# EAGLE board electrosteel2020 (EAGLE 9.2.2), part 1 of 2
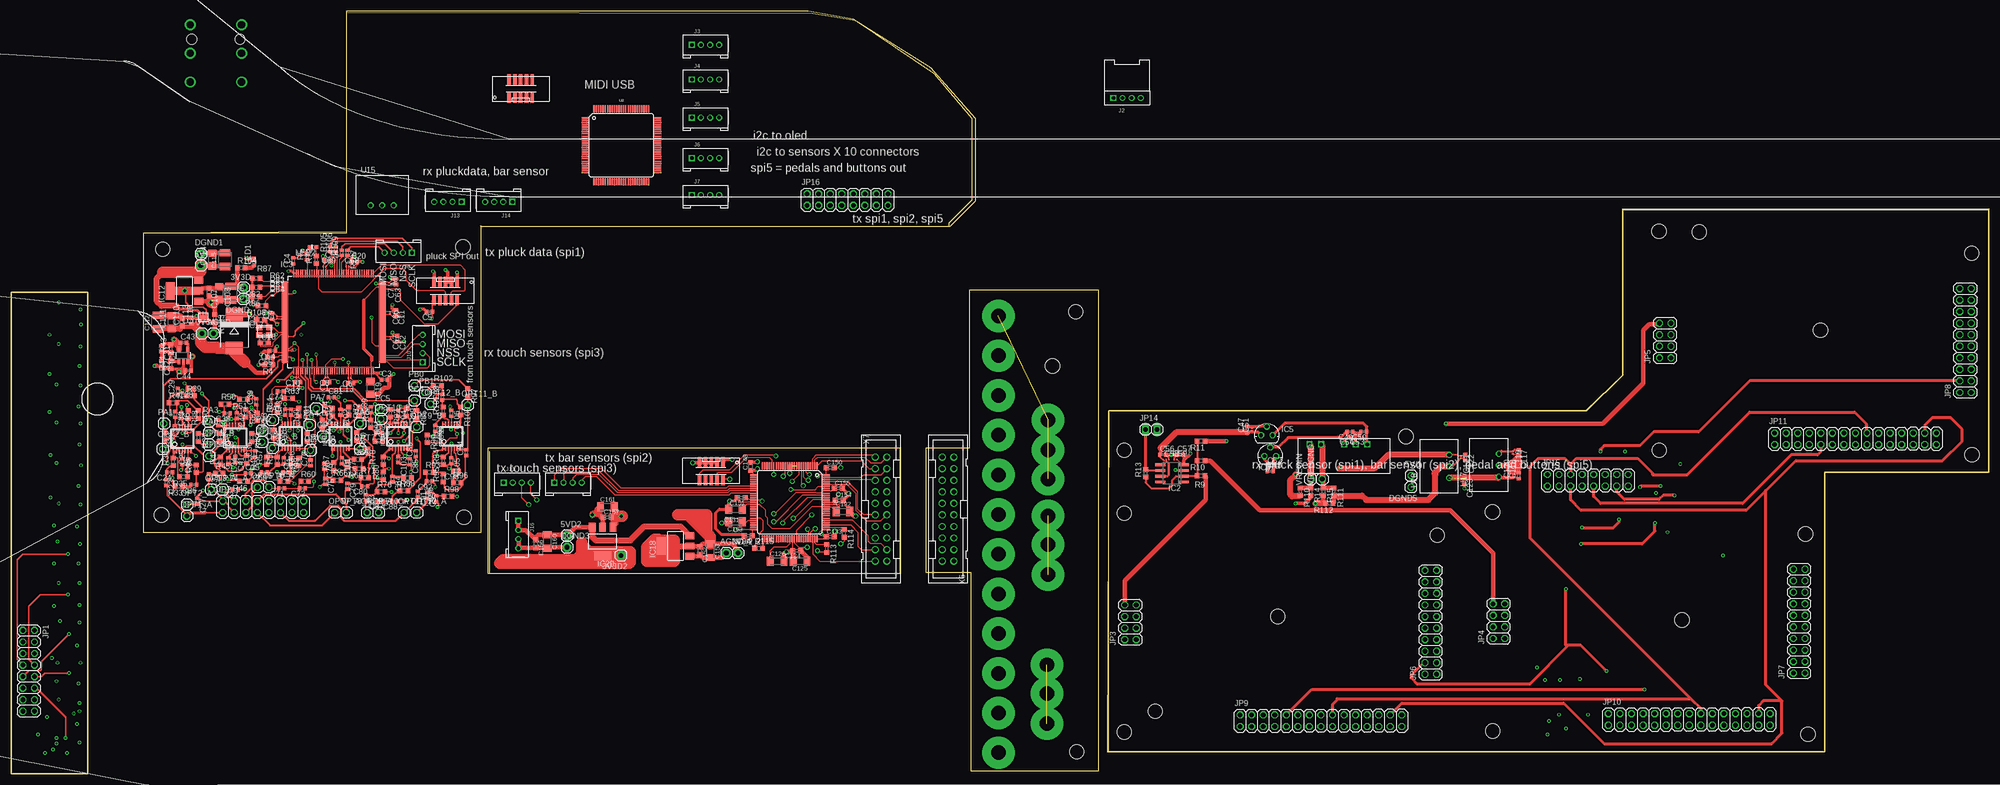
[diagram p5: board, top side]
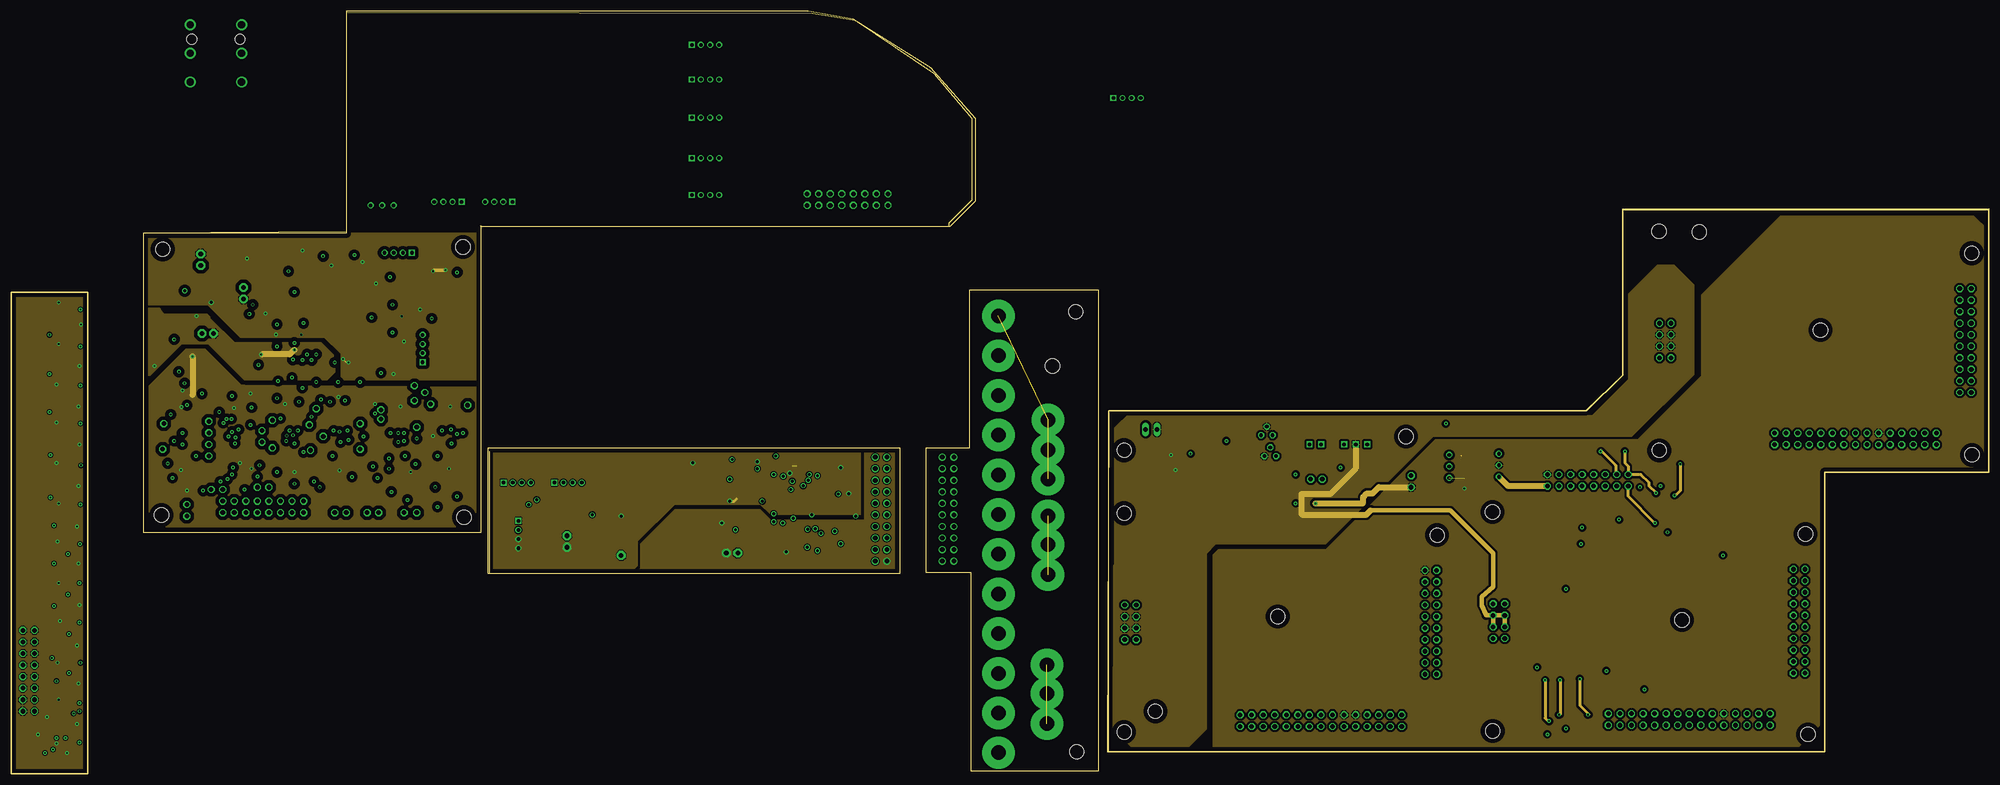
[diagram p6: board, inner layer Route2]
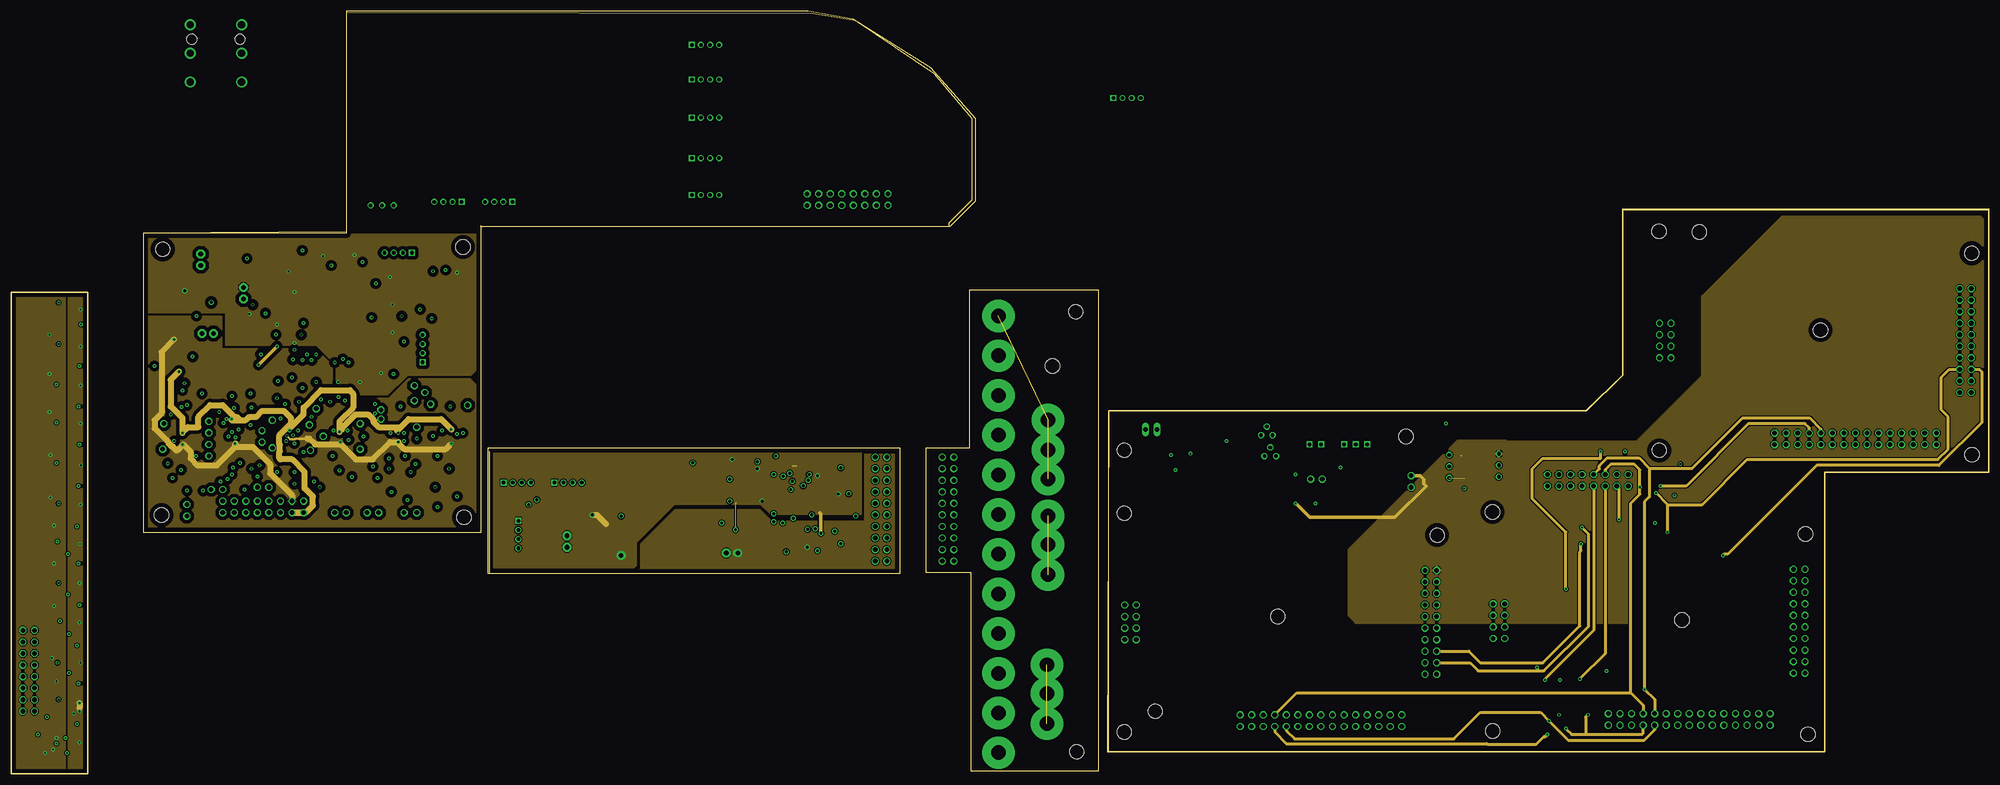
[diagram p7: board, inner layer Route15]
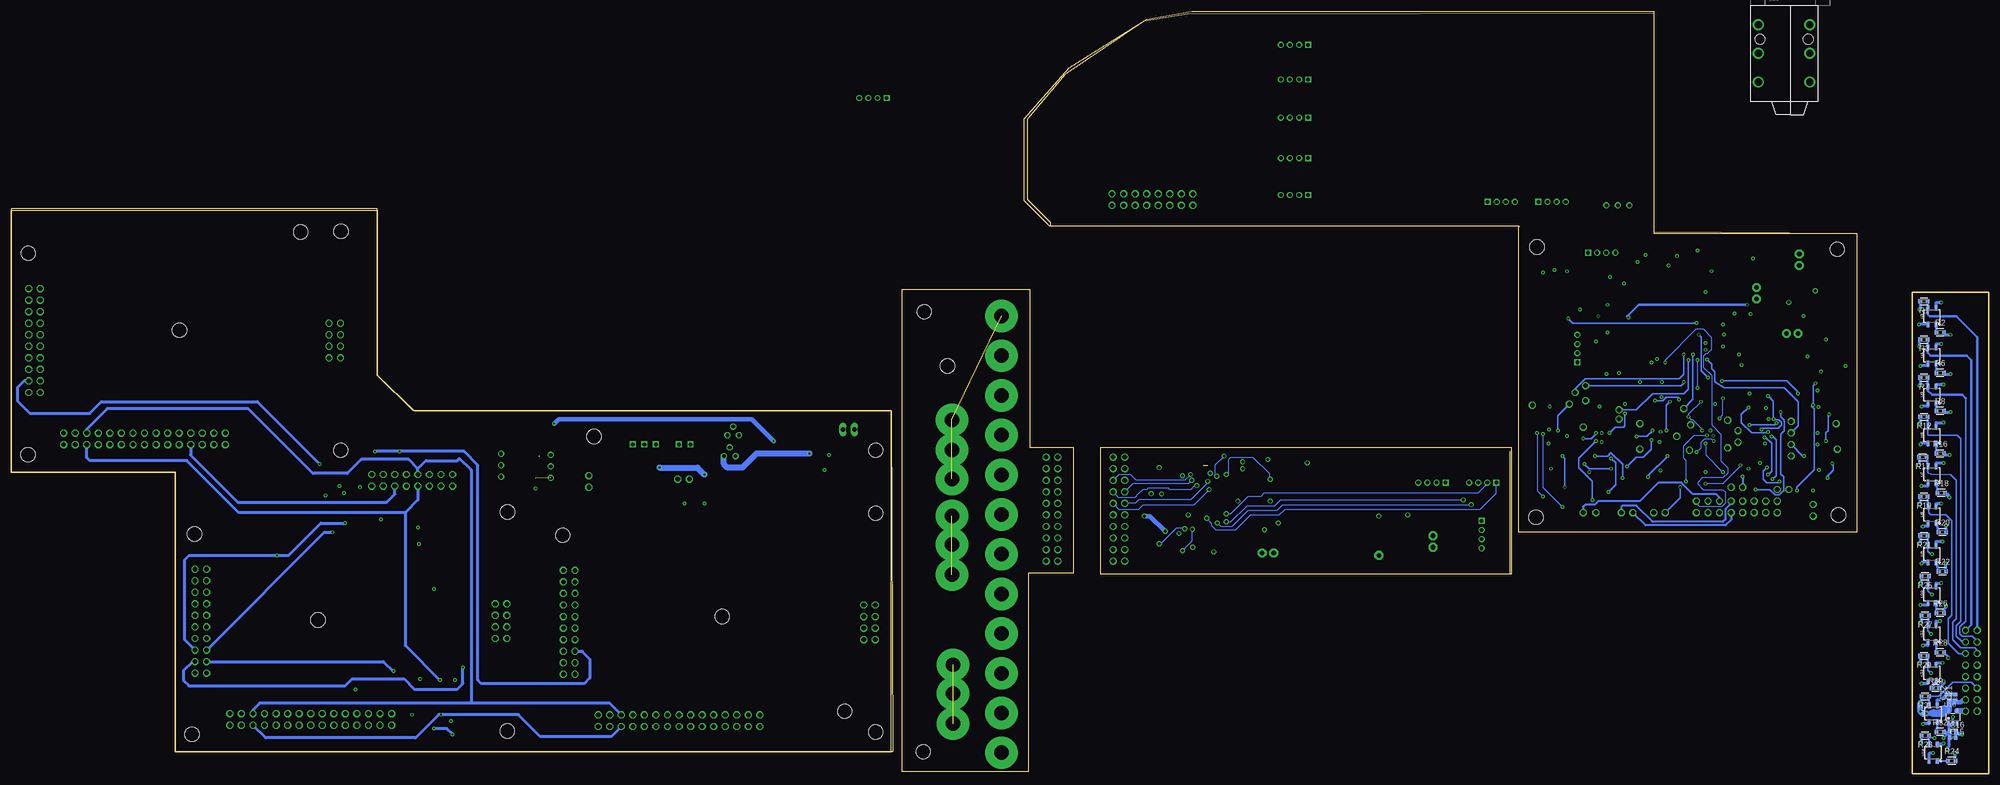
[diagram p8: board, bottom side, seen from below]

Size 434.85 x 167.64 mm. Coordinates in mm from the lower left corner, seen from the top.
Outline: 103.38,120.4 103.38,53.09 28.96,53.09 28.96,118.87 73.66,118.87 73.66,167.64 175.26,167.64 185.17,165.86 202.18,155.19 212.09,144.02 212.09,125.98 206.5,120.4 103.38,120.4
Outline: 103.38,120.4 103.12,120.4
Outline: 241.3,79.76 241.05,4.83 398.78,4.83 398.78,66.29 434.85,66.29 434.85,123.95 354.33,123.95 354.33,87.63 346.2,79.76 241.3,79.76
Outline: 0,105.92 16.76,105.92 16.76,0 0,0 0,105.92
Outline: 210.82,106.43 239.01,106.43 239.01,0.51 211.07,0.51 211.07,44.2 201.17,44.2 201.17,71.63 210.82,71.63 210.82,106.43
Outline: 195.33,71.63 195.33,43.94 104.9,43.94 104.9,71.63 195.33,71.63
Copper layers (1+2*15+16): Top 0.035mm / dielectric 0.5mm / Route2 0.035mm / dielectric 0.5mm / Route15 0.035mm / dielectric 0.5mm / Bottom 0.035mm
Design rules "default *": minimum track width 6mil, minimum drill 0.35mm, track to track 9mil, track to pad 9mil, pad to pad 9mil, via to via 9mil, smd to smd 9mil, copper to edge 40mil, drill to drill 6mil, minimum pad ring 10mil, minimum via ring 8mil, stop-mask expansion 4mil, vias tented up to drill 0mil, thermal gap 10mil
Holes 3.17 mm at 244.73,57.28 313.56,52.45 244.73,9.14 325.75,57.53 394.59,52.7 325.81,9.37 362.33,119.28 431.14,114.45 362.41,71.09 234.31,4.83 234.06,101.6 228.98,89.66 33.02,56.9 33.27,115.32 99.31,115.82 99.57,56.39 278.51,34.54 367.41,33.78 397.89,97.54 306.7,74.17 244.73,71.12 431.17,70.1 371.22,119.13 251.59,13.72 395.1,8.64
Milling: 38 lines

## Footprints (pad centres in the part's own frame; a part is rotated, then mirrored left to right if it is on the bottom)
1X01 = drill 1.016 pad 1.93 octagon: 1 0,0
1X01' = drill 1.016 octagon: 1 0,0
C0402 = smd 0.7 x 0.9: 1 -0.65,0; 2 0.65,0
C0201 = smd 0.25 x 0.35: 1 -0.25,0; 2 0.25,0
C0603 = smd 1.1 x 1: 1 -0.85,0; 2 0.85,0
C1206 = smd 1.6 x 1.8: 1 -1.4,0; 2 1.4,0
SMC_B = smd 1.6 x 2.4: + -1.5,0; - 1.5,0
C0603K = smd 1.05 x 1.08: 1 -0.875,0; 2 0.875,0
C1206K = smd 1.5 x 2: 1 -1.5,0; 2 1.5,0
SMC = smd 2.8 x 3.8: A 3.7,0; C -3.7,0
TSSOP14 = smd 0.305 x 0.991: 1 -1.905,-2.718; 2 -1.27,-2.718; 3 -0.635,-2.718; 4 0,-2.718; 5 0.635,-2.718; 6 1.27,-2.718; 7 1.905,-2.718; 8 1.905,2.718; 9 1.27,2.718; 10 0.635,2.718; 11 0,2.718; 12 -0.635,2.718; 13 -1.27,2.718; 14 -1.905,2.718
SO08 = smd 0.6 x 2.2: 1 -1.905,-2.6; 2 -0.635,-2.6; 3 0.635,-2.6; 4 1.905,-2.6; 5 1.905,2.6; 6 0.635,2.6; 7 -0.635,2.6; 8 -1.905,2.6
QFP50P2200X2200X160-144N = smd 1.56 x 0.28: 1 -10.68,8.75; 2 -10.68,8.25; 3 -10.68,7.75; 4 -10.68,7.25; 5 -10.68,6.75; 6 -10.68,6.25; 7 -10.68,5.75; 8 -10.68,5.25; 9 -10.68,4.75; 10 -10.68,4.25; 11 -10.68,3.75; 12 -10.68,3.25; 13 -10.68,2.75; 14 -10.68,2.25; 15 -10.68,1.75; 16 -10.68,1.25; 17 -10.68,0.75; 18 -10.68,0.25; 19 -10.68,-0.25; 20 -10.68,-0.75; 21 -10.68,-1.25; 22 -10.68,-1.75; 23 -10.68,-2.25; 24 -10.68,-2.75; 25 -10.68,-3.25; 26 -10.68,-3.75; 27 -10.68,-4.25; 28 -10.68,-4.75; 29 -10.68,-5.25; 30 -10.68,-5.75; 31 -10.68,-6.25; 32 -10.68,-6.75; 33 -10.68,-7.25; 34 -10.68,-7.75; 35 -10.68,-8.25; 36 -10.68,-8.75; 73 10.68,-8.75; 74 10.68,-8.25; 75 10.68,-7.75; 76 10.68,-7.25; 77 10.68,-6.75; 78 10.68,-6.25; 79 10.68,-5.75; 80 10.68,-5.25; 81 10.68,-4.75; 82 10.68,-4.25; 83 10.68,-3.75; 84 10.68,-3.25; 85 10.68,-2.75; 86 10.68,-2.25; 87 10.68,-1.75; 88 10.68,-1.25; 89 10.68,-0.75; 90 10.68,-0.25; 91 10.68,0.25; 92 10.68,0.75; 93 10.68,1.25; 94 10.68,1.75; 95 10.68,2.25; 96 10.68,2.75; 97 10.68,3.25; 98 10.68,3.75; 99 10.68,4.25; 100 10.68,4.75; 101 10.68,5.25; 102 10.68,5.75; 103 10.68,6.25; 104 10.68,6.75; 105 10.68,7.25; 106 10.68,7.75; 107 10.68,8.25; 108 10.68,8.75 | smd 0.28 x 1.56: 37 -8.75,-10.68; 38 -8.25,-10.68; 39 -7.75,-10.68; 40 -7.25,-10.68; 41 -6.75,-10.68; 42 -6.25,-10.68; 43 -5.75,-10.68; 44 -5.25,-10.68; 45 -4.75,-10.68; 46 -4.25,-10.68; 47 -3.75,-10.68; 48 -3.25,-10.68; 49 -2.75,-10.68; 50 -2.25,-10.68; 51 -1.75,-10.68; 52 -1.25,-10.68; 53 -0.75,-10.68; 54 -0.25,-10.68; 55 0.25,-10.68; 56 0.75,-10.68; 57 1.25,-10.68; 58 1.75,-10.68; 59 2.25,-10.68; 60 2.75,-10.68; 61 3.25,-10.68; 62 3.75,-10.68; 63 4.25,-10.68; 64 4.75,-10.68; 65 5.25,-10.68; 66 5.75,-10.68; 67 6.25,-10.68; 68 6.75,-10.68; 69 7.25,-10.68; 70 7.75,-10.68; 71 8.25,-10.68; 72 8.75,-10.68; 109 8.75,10.68; 110 8.25,10.68; 111 7.75,10.68; 112 7.25,10.68; 113 6.75,10.68; 114 6.25,10.68; 115 5.75,10.68; 116 5.25,10.68; 117 4.75,10.68; 118 4.25,10.68; 119 3.75,10.68; 120 3.25,10.68; 121 2.75,10.68; 122 2.25,10.68; 123 1.75,10.68; 124 1.25,10.68; 125 0.75,10.68; 126 0.25,10.68; 127 -0.25,10.68; 128 -0.75,10.68; 129 -1.25,10.68; 130 -1.75,10.68; 131 -2.25,10.68; 132 -2.75,10.68; 133 -3.25,10.68; 134 -3.75,10.68; 135 -4.25,10.68; 136 -4.75,10.68; 137 -5.25,10.68; 138 -5.75,10.68; 139 -6.25,10.68; 140 -6.75,10.68; 141 -7.25,10.68; 142 -7.75,10.68; 143 -8.25,10.68; 144 -8.75,10.68
SOT23-5 = smd 0.6 x 1.2: 1 -0.95,-1.306; 2 0,-1.306; 3 0.95,-1.306; 4 0.95,1.306; 5 -0.95,1.306
78LXX = drill 0.813 octagon: GND 0,1.905; IN 1.27,0; OUT -1.27,0
79LXX = drill 0.813 octagon: GND -1.27,0; IN 0,1.905; OUT 1.27,0
6-WSON = smd 0.45 x 0.3: 1 -0.975,0.65; 2 -0.975,0; 3 -0.975,-0.65; 4 0.975,-0.65; 5 0.975,0; 6 0.975,0.65 | smd 0.9 x 1.6: PAD 0,0
SOT223 = smd 1.499 x 2.007: 1 -2.261,-3.15; 2 0.025,-3.15; 3 2.311,-3.15 | smd 3.81 x 2.007: PAD 0,3.15
AUDIO_JACK_0.25"_TRS_PTH_RA = drill 1.6: RING 10.5,-6.95; RING-NORM 10.5,4.35; SLEEVE 4.2,-6.95; SLEEVE-NORM 4.2,4.35; TIP 16.8,-6.95; TIP-NORM 16.8,4.35 | hole 2.2: 7.4,4; 7.4,-6.6
HW4-2.0-90D = drill 0.8 pad 1.27 square: 1 -3,0 | drill 0.8 pad 1.27: 2 -1,0; 3 1,0; 4 3,0
HW4-2.0 = drill 0.8 pad 1.27 square: 1 -3,0 | drill 0.8 pad 1.27: 2 -1,0; 3 1,0; 4 3,0
RJ45-8 = drill 1 pad 1.88 square: 1 -4.445,6.35 | drill 1 pad 1.88: 2 -3.175,8.89; 3 -1.905,6.35; 4 -0.635,8.89; 5 0.635,6.35; 6 1.905,8.89; 7 3.175,6.35; 8 4.445,8.89 | hole 3.2: -5.715,0; 5.715,0
CUI_UJ31-CH-312-SMT-TR = smd 0.32 x 0.7: A1 0,0; A2 0.5,0; A3 1,0; A4 1.5,0; A5 2,0; A6 2.5,0; A7 3,0; A8 3.5,0; A9 4,0; A10 4.5,0; A11 5,0; A12 5.5,0 | drill 0.4 pad 0.6: B1 5.55,-1.31; B2 5.15,-2.01; B3 4.35,-2.01; B4 3.95,-1.31; B5 3.55,-2.01; B6 3.15,-1.31; B7 2.35,-1.31; B8 1.95,-2.01; B9 1.55,-1.31; B10 1.15,-2.01; B11 0.35,-2.01; B12 -0.05,-1.31 | drill 0.6 pad 0.7 long: SH1 -0.62,0.89; SH2 6.12,0.89 | drill 0.6 pad 0.8 long: SH3 -1.255,-1.66; SH4 6.755,-1.66 | drill 0.6 pad 0.9 long: SH5 -1.58,-2.16; SH6 7.08,-2.16; SH7 -1.58,-7.86; SH8 7.08,-7.86 | hole 0.85: -0.85,-0.66; 6.35,-0.66
2X08 = drill 1.016 octagon: 1 -8.89,-1.27; 2 -8.89,1.27; 3 -6.35,-1.27; 4 -6.35,1.27; 5 -3.81,-1.27; 6 -3.81,1.27; 7 -1.27,-1.27; 8 -1.27,1.27; 9 1.27,-1.27; 10 1.27,1.27; 11 3.81,-1.27; 12 3.81,1.27; 13 6.35,-1.27; 14 6.35,1.27; 15 8.89,-1.27; 16 8.89,1.27
2X04 = drill 1.016 octagon: 1 -3.81,-1.27; 2 -3.81,1.27; 3 -1.27,-1.27; 4 -1.27,1.27; 5 1.27,-1.27; 6 1.27,1.27; 7 3.81,-1.27; 8 3.81,1.27
2X10 = drill 1.016 octagon: 1 -11.43,-1.27; 2 -11.43,1.27; 3 -8.89,-1.27; 4 -8.89,1.27; 5 -6.35,-1.27; 6 -6.35,1.27; 7 -3.81,-1.27; 8 -3.81,1.27; 9 -1.27,-1.27; 10 -1.27,1.27; 11 1.27,-1.27; 12 1.27,1.27; 13 3.81,-1.27; 14 3.81,1.27; 15 6.35,-1.27; 16 6.35,1.27; 17 8.89,-1.27; 18 8.89,1.27; 19 11.43,-1.27; 20 11.43,1.27
2X15 = drill 1.016 octagon: 1 -17.78,-1.27; 2 -17.78,1.27; 3 -15.24,-1.27; 4 -15.24,1.27; 5 -12.7,-1.27; 6 -12.7,1.27; 7 -10.16,-1.27; 8 -10.16,1.27; 9 -7.62,-1.27; 10 -7.62,1.27; 11 -5.08,-1.27; 12 -5.08,1.27; 13 -2.54,-1.27; 14 -2.54,1.27; 15 0,-1.27; 16 0,1.27; 17 2.54,-1.27; 18 2.54,1.27; 19 5.08,-1.27; 20 5.08,1.27; 21 7.62,-1.27; 22 7.62,1.27; 23 10.16,-1.27; 24 10.16,1.27; 25 12.7,-1.27; 26 12.7,1.27; 27 15.24,-1.27; 28 15.24,1.27; 29 17.78,-1.27; 30 17.78,1.27
1X02 = drill 1.016 long: 1 -1.27,0; 2 1.27,0
1X04 = drill 1.016 long: 1 -3.81,0; 2 -1.27,0; 3 1.27,0; 4 3.81,0
CHIP-LED0603 = smd 0.8 x 0.8: A 0,-0.75; C 0,0.75
NX3225 = smd 1.4 x 1.2: 1 -1.1,-0.8; 2 1.1,-0.8; 3 1.1,0.8; 4 -1.1,0.8
RESC1608X60 = smd 0.799 x 0.974: 1 -0.815,0; 2 0.815,0
R0603 = smd 1 x 1.1: 1 -0.85,0; 2 0.85,0
R0402 = smd 0.7 x 0.9: 1 -0.55,0; 2 0.55,0
R0201 = smd 0.28 x 0.43: 1 -0.255,0; 2 0.255,0
TACTILE_SWITCH_PTH_6.0MM = drill 1.016 pad 1.88: 1 -3.251,2.261; 2 3.251,2.261; 3 -3.251,-2.261; 4 3.251,-2.261
TQFP-100-14X14MM = smd 1.5 x 0.27: 1 -8,6; 2 -8,5.5; 3 -8,5; 4 -8,4.5; 5 -8,4; 6 -8,3.5; 7 -8,3; 8 -8,2.5; 9 -8,2; 10 -8,1.5; 11 -8,1; 12 -8,0.5; 13 -8,0; 14 -8,-0.5; 15 -8,-1; 16 -8,-1.5; 17 -8,-2; 18 -8,-2.5; 19 -8,-3; 20 -8,-3.5; 21 -8,-4; 22 -8,-4.5; 23 -8,-5; 24 -8,-5.5; 25 -8,-6; 51 8,-6; 52 8,-5.5; 53 8,-5; 54 8,-4.5; 55 8,-4; 56 8,-3.5; 57 8,-3; 58 8,-2.5; 59 8,-2; 60 8,-1.5; 61 8,-1; 62 8,-0.5; 63 8,0; 64 8,0.5; 65 8,1; 66 8,1.5; 67 8,2; 68 8,2.5; 69 8,3; 70 8,3.5; 71 8,4; 72 8,4.5; 73 8,5; 74 8,5.5; 75 8,6 | smd 0.27 x 1.5: 26 -6,-8; 27 -5.5,-8; 28 -5,-8; 29 -4.5,-8; 30 -4,-8; 31 -3.5,-8; 32 -3,-8; 33 -2.5,-8; 34 -2,-8; 35 -1.5,-8; 36 -1,-8; 37 -0.5,-8; 38 0,-8; 39 0.5,-8; 40 1,-8; 41 1.5,-8; 42 2,-8; 43 2.5,-8; 44 3,-8; 45 3.5,-8; 46 4,-8; 47 4.5,-8; 48 5,-8; 49 5.5,-8; 50 6,-8; 76 6,8; 77 5.5,8; 78 5,8; 79 4.5,8; 80 4,8; 81 3.5,8; 82 3,8; 83 2.5,8; 84 2,8; 85 1.5,8; 86 1,8; 87 0.5,8; 88 0,8; 89 -0.5,8; 90 -1,8; 91 -1.5,8; 92 -2,8; 93 -2.5,8; 94 -3,8; 95 -3.5,8; 96 -4,8; 97 -4.5,8; 98 -5,8; 99 -5.5,8; 100 -6,8
QRE1113 = smd 1.2 x 0.6: 1 -1.8,-0.9; 2 1.8,-0.9; 3 1.8,0.9; 4 -1.8,0.9
DC-DC_CONVERTER_78XX = drill 0.8: GND 0,0; VIN -2.54,0; VOUT 2.54,0
TEXAS_SOT23-5 = smd 0.55 x 1.2: 1 -0.95,-1.3; 2 0,-1.3; 3 0.95,-1.3; 4 0.95,1.3; 5 -0.95,1.3
RK09 = drill 1.2 square: 1-09 -2.5,-7.5; 2-09 0,-7.5; 3-09 2.5,-7.5 | drill 1.854 square: MOUNT1 -4.683,0; MOUNT2 4.683,0
CMR0512S3C = drill 0.8 square: P$1 -7.62,0; P$2 -5.08,0; P$3 0,0; P$4 2.54,0; P$5 5.08,0
SS-7188VS-A-FLS_RJ45 = drill 0.889 square: P$1 -4.445,4.445; P$2 -3.175,6.985; P$3 -1.905,4.445; P$4 -0.635,6.985; P$5 0.635,4.445; P$6 1.905,6.985; P$7 3.175,4.445; P$8 4.445,6.985 | drill 1.651 square: P$9 -7.874,1.981; P$10 7.874,1.981 | hole 3.277: -5.715,-1.905; 5.715,-1.905
3221-10-0300-00 = smd 0.76 x 2.4: 1 -2.54,-1.87; 2 -2.54,1.97; 3 -1.27,-1.87; 4 -1.27,1.97; 5 0,-1.87; 6 0,1.97; 7 1.27,-1.87; 8 1.27,1.97; 9 2.54,-1.87; 10 2.54,1.97
PAK100/2500-20 = drill 1 pad 1.422: 1 -11.43,-1.27; 2 -11.43,1.27; 3 -8.89,-1.27; 4 -8.89,1.27; 5 -6.35,-1.27; 6 -6.35,1.27; 7 -3.81,-1.27; 8 -3.81,1.27; 9 -1.27,-1.27; 10 -1.27,1.27; 11 1.27,-1.27; 12 1.27,1.27; 13 3.81,-1.27; 14 3.81,1.27; 15 6.35,-1.27; 16 6.35,1.27; 17 8.89,-1.27; 18 8.89,1.27; 19 11.43,-1.27; 20 11.43,1.27

## Placement (x,y rotation side)
3V3A  [1X01]  41.91,96.77 0 top
3V3A_2  [1X01]  159.77,48.51 0 top
3V3D  [1X01]  51.05,106.93 0 top
3V3D2  [1X01]  134.11,48.01 180 top
5V  [1X01]  41.66,111.76 0 top
5V/1  PINHD-1X1  [1X01']  307.85,65.53 0 top
5VD2  [1X01]  122.17,52.32 0 top
AGND  [1X01]  44.45,96.77 0 top
AGND_2  [1X01]  157.23,48.51 0 top
C1  .1uf  [C0402]  69.34,86.11 180 top
C2  .1uf  [C0402]  57.4,100.58 90 top
C3  .1uf  [C0402]  82.04,86.61 0 top
C4  .1uf  [C0402]  61.98,112.78 90 top
C5  .1uf  [C0402]  91.95,101.6 180 top
C6  .01uf  [C0201]  74.37,87 180 top
C7  .01uf  [C0201]  83.06,107.7 270 top
C8  .01uf  [C0201]  69.34,87.12 180 top
C9  .01uf  [C0201]  58.42,100.33 90 top
C10  .01uf  [C0201]  62.86,87.15 180 top
C11  .1uf  [C0402]  84.58,101.35 270 top
C12  .1uf  [C0402]  84.84,95.76 270 top
C13  .1uf  [C0402]  74.68,85.85 180 top
C14  .1uf  [C0402]  62.99,86.11 180 top
C15  .1uf  [C0402]  7.87,7.87 0 bottom
C16  .01uf  [C0402]  7.87,9.4 0 bottom
C17  18pf  [C0603]  54.86,99.82 180 top
C18  18pf  [C0603]  55.63,94.74 0 top
C19  2.2uf  [C1206]  78.99,84.84 270 top
C20  .1uf  [C0402]  75.44,112.52 0 top
C21  .01uf  [C0402]  7.37,16.76 90 bottom
C22  .1uf  [C0402]  8.64,16.76 90 bottom
C23  .1uf  [C0402]  34.04,64.01 270 top
C24  .1uf  [C0402]  34.8,66.29 180 top
C25  .1uf  [C0402]  38.86,68.58 90 top
C26  .1uf  [C0402]  40.13,63.5 180 top
C27  .1uf  [C0402]  40.89,59.94 270 top
C28  .1uf  [C0402]  39.37,84.58 180 top
C29  .1uf  [C0402]  36.58,84.07 90 top
C30  .1uf  [C0402]  36.07,78.99 270 top
C31  .1uf  [C0402]  33.02,93.47 270 top
C32  .1uf  [C0402]  33.02,90.17 270 top
C33  .1uf  [C0402]  43.43,65.28 270 top
C34  .1uf  [C0402]  47.75,68.83 270 top
C35  .1uf  [C0402]  52.07,66.04 0 top
C36  .1uf  [C0402]  53.59,70.36 90 top
C37  .1uf  [C0402]  49.28,62.48 180 top
C38  .1uf  [C0402]  47.5,79.25 180 top
C39  .1uf  [C0402]  53.85,81.79 90 top
C40  .1uf  [C0402]  45.47,77.22 270 top
C41  .1uf  [C0402]  49.28,69.09 270 top
C42  .1uf  [C0402]  49.53,78.74 270 top
C43  .1uf  [C0402]  37.85,94.74 0 top
C44  .1uf  [C0402]  38.86,88.65 180 top
C45  .1uf  [C0402]  37.59,68.58 270 top
C46  .1uf  [C0402]  37.34,78.74 270 top
C47  .1uf  [C0402]  271.78,75.69 90 top
C48  .1uf  [C0402]  276.86,66.55 0 top
C49  .1uf  [C0402]  294.39,75.18 180 top
C50  .1uf  [C0402]  297.43,75.18 180 top
C51  .01uf  [C0201]  272.8,75.69 90 top
C52  .01uf  [C0201]  276.86,67.56 0 top
C53  .01uf  [C0201]  296.93,74.17 180 top
C54  .01uf  [C0201]  294.64,74.17 180 top
C55  .1uf  [C0402]  69.6,112.78 0 top
C56  .1uf  [C0402]  253.24,70.1 0 top
C57  .1uf  [C0402]  257.05,70.1 0 top
C58  .01uf  [C0201]  254.25,69.09 0 top
C59  .01uf  [C0201]  256.03,69.09 0 top
C60  .1uf  [C0402]  55.63,66.29 180 top
C61  .1uf  [C0402]  59.94,68.83 270 top
C62  .1uf  [C0402]  60.45,66.29 0 top
C63  .1uf  [C0402]  84.58,108.2 270 top
C64  .01uf  [C0402]  57.4,92.96 180 top
C65  .01uf  [C0402]  56.87,91.69 180 top
C66  .01uf  [C0201]  83.31,101.35 270 top
C67  .01uf  [C0201]  83.34,95.83 270 top
C68  .01uf  [C0201]  73.91,111.51 0 top
C69  .01uf  [C0201]  68.86,111.51 0 top
C70  .1uf  [C0402]  65.79,68.33 90 top
C71  .1uf  [C0402]  59.44,62.74 180 top
C72  .1uf  [C0402]  64.01,62.74 180 top
C73  .1uf  [C0402]  60.2,79.5 90 top
C74  .1uf  [C0402]  59.18,84.07 180 top
C75  .1uf  [C0402]  69.09,64.26 270 top
C76  .1uf  [C0402]  68.83,67.56 270 top
C77  .1uf  [C0402]  73.91,68.07 270 top
C78  .1uf  [C0402]  78.49,70.87 90 top
C79  .1uf  [C0402]  73.91,63.25 270 top
C80  .1uf  [C0402]  77.72,63.25 180 top
C81  .1uf  [C0402]  70.36,82.8 0 top
C82  .1uf  [C0402]  68.83,80.26 270 top
C83  .1uf  [C0402]  77.98,60.71 270 top
C84  .1uf  [C0402]  83.82,64.77 270 top
C85  .1uf  [C0402]  87.63,68.58 270 top
C86  .1uf  [C0402]  88.9,70.36 90 top
C87  .1uf  [C0402]  81.28,59.94 180 top
C88  .1uf  [C0402]  84.33,59.94 180 top
C89  .1uf  [C0402]  78.99,80.01 90 top
C90  .1uf  [C0402]  80.77,74.93 0 top
C91  .1uf  [C0402]  89.41,61.47 270 top
C92  .1uf  [C0402]  91.95,64.26 180 top
C93  .1uf  [C0402]  97.79,66.55 180 top
C94  .1uf  [C0402]  100.08,70.61 90 top
C95  .1uf  [C0402]  91.44,61.21 270 top
C96  .1uf  [C0402]  93.47,60.45 90 top
C97  .1uf  [C0402]  93.22,75.95 270 top
C98  .1uf  [C0402]  94.74,82.8 90 top
C99  .1uf  [C0402]  61.47,68.83 270 top
C100  .1uf  [C0402]  61.47,79.5 270 top
C101  .1uf  [C0402]  72.64,68.83 270 top
C102  .1uf  [C0402]  72.39,79.5 270 top
C103  .1uf  [C0402]  85.09,69.09 270 top
C104  .1uf  [C0402]  85.09,79.25 270 top
C105  .1uf  [C0402]  96.77,68.83 270 top
C106  .1uf  [C0402]  96.77,79.25 270 top
C107  .1uf  [C0603]  43.43,105.92 270 top
C108  1uf  [C1206]  45.72,105.66 270 top
C109  10uf  [SMC_B]  48.26,105.66 270 top
C110  .1uf  [C0603]  37.59,99.31 90 top
C111  1uf  [C1206]  35.31,99.31 90 top
C112  10uf  [SMC_B]  32.26,99.31 90 top
C113  .1uf  [C0402]  39.62,99.57 90 top
C114  1uf  [C1206]  44.2,113.03 90 top
C115  10uf  [SMC_B]  46.99,113.03 90 top
C116  .01uf  [C0201]  40.64,99.57 90 top
C117  .1uf  [C0402]  331.47,70.61 270 top
C118  .1uf  [C0402]  331.47,65.53 90 top
C119  .01uf  [C0201]  330.2,70.61 270 top
C120  .01uf  [C0201]  330.23,65.58 90 top
C121  .01uf  [C0201]  318.77,69.6 270 top
C122  .1uf  [C0402]  319.79,69.6 270 top
C123  .1uf  [C0402]  319.53,64.26 270 top
C124  .1uf  [C0603K]  172.72,49.02 180 top
C125  1uf  [C1206K]  173.48,46.74 180 top
C126  1uf  [C1206K]  168.4,46.74 0 top
C131  1uf  [C1206K]  159.26,58.17 180 top
C132  1uf  [C1206K]  182.88,57.66 0 top
C133  .1uf  [C0603K]  180.09,52.07 0 top
C148  .1uf  [C0603K]  162.56,67.56 90 top
C149  .1uf  [C0603K]  162.05,52.32 180 top
C150  .1uf  [C0603K]  180.09,67.31 0 top
C151  .1uf  [C0603K]  160.53,60.71 180 top
C152  .1uf  [C0603K]  151.38,49.02 270 top
C153  10uf  [C1206K]  153.67,49.02 270 top
C154  .1uf  [C0603K]  182.09,60.15 0 top
C155  2200pf  [C0603K]  181.86,62.74 0 top
C156  .1uf  [C0603K]  115.32,50.55 270 top
C157  .1uf  [C0603K]  131.06,56.39 0 top
C160  10uf  [C1206K]  117.86,51.05 270 top
C161  10uf  [C1206K]  131.06,58.67 0 top
C163  1uf  [C1206K]  159.26,55.37 180 top
D3  MBRS340T3  [SMC]  49.02,97.28 270 top
DGND  [1X01]  51.05,104.39 180 top
DGND1  [1X01]  41.66,114.3 0 top
DGND3  [1X01]  122.17,49.78 0 top
DGND5  PINHD-1X1  [1X01']  307.85,62.99 180 top
IC1  OPA4344E  [TSSOP14]  49.28,73.91 0 top
IC2  OPA134D  [SO08]  255.27,66.04 90 top
IC3  STM32H743ZIT6  [QFP50P2200X2200X160-144N]  70.87,99.31 0 top
IC4  LMV321M5  [SOT23-5]  37.85,91.95 0 top
IC5  [78LXX]  276.1,74.42 0 top
IC6  [79LXX]  276.86,69.85 0 top
IC7  OPA4344E  [TSSOP14]  61.47,74.17 0 top
IC8  OPA4344E  [TSSOP14]  72.39,74.17 0 top
IC9  OPA4344E  [TSSOP14]  85.09,74.17 0 top
IC10  OPA4344E  [TSSOP14]  96.77,74.17 0 top
IC11  LP5912  [6-WSON]  42.16,100.33 90 top
IC12  REG1117  [SOT223]  38.1,106.17 90 top
IC17  OPA4344E  [TSSOP14]  37.59,73.66 0 top
IC18  REG1117  [SOT223]  146.05,50.04 90 top
IC20  REG1117  [SOT223]  130.05,51.05 180 top
J1  AUDIO_JACK_TRS_0.25"_PTH_RA  [AUDIO_JACK_0.25"_TRS_PTH_RA]  43.69,168.91 270 bottom
J2  4P-2.0-90D  [HW4-2.0-90D]  245.36,148.59 0 top
J3  4P-2.0  [HW4-2.0]  152.65,160.27 0 top
J4  4P-2.0  [HW4-2.0]  152.65,152.65 0 top
J5  4P-2.0  [HW4-2.0]  152.65,144.27 0 top
J6  4P-2.0  [HW4-2.0]  152.65,135.38 0 top
J7  4P-2.0  [HW4-2.0]  152.65,127.25 0 top
J8  4P-2.0  [HW4-2.0]  85.09,114.55 180 top
J9  RJ45  [RJ45-8]  672.34,78.49 180 top  (outside the outline)
J10  4P-2.0  [HW4-2.0]  90.42,93.47 90 top
J11  4P-2.0  [HW4-2.0]  111.25,64.01 0 top
J12  4P-2.0  [HW4-2.0]  122.43,64.01 0 top
J13  4P-2.0  [HW4-2.0]  96.01,125.73 180 top
J14  4P-2.0  [HW4-2.0]  107.19,125.73 180 top
J15  UJ31-CH-312-SMT-TR  [CUI_UJ31-CH-312-SMT-TR]  -30.48,-19.05 0 top  (outside the outline)
J16  4P-2.0  [HW4-2.0]  111.51,52.58 270 top
JP1  PINHD-2X8  [2X08]  3.81,22.61 270 top
JP2  PINHD-2X8  [2X08]  55.37,58.67 0 top
JP3  PINHD-2X4  [2X04]  246.13,33.27 90 top
JP4  PINHD-2X4  [2X04]  327.15,33.53 90 top
JP5  PINHD-2X4  [2X04]  363.73,95.25 90 top
JP6  PINHD-2X10  [2X10]  312.17,33.27 90 top
JP7  PINHD-2X10  [2X10]  393.19,33.53 90 top
JP8  PINHD-2X10  [2X10]  429.77,95.25 90 top
JP9  [2X15]  288.01,11.63 0 top
JP10  [2X15]  369.01,11.91 0 top
JP11  [2X15]  405.56,73.63 0 top
JP14  PINHD-1X2  [1X02]  250.7,75.69 0 top
JP15  PINHD-2X8  [2X08]  346.71,64.52 0 top
JP16  PINHD-2X8  [2X08]  183.9,126.24 0 top
JP40  [1X04]  -29.72,-35.31 0 top  (outside the outline)
LED1  RED  [CHIP-LED0603]  53.34,112.52 0 top
LED2  GREEN  [CHIP-LED0603]  66.29,115.82 90 top
OPT1_A  PINHD-1X1  [1X01']  38.61,56.64 0 top
OPT1_B  PINHD-1X1  [1X01']  43.43,72.39 0 top
OPT2_A  PINHD-1X1  [1X01']  38.61,59.18 0 top
OPT2_B  PINHD-1X1  [1X01']  33.27,71.37 0 top
OPT3_A  PINHD-1X1  [1X01']  43.94,62.48 0 top
OPT3_B  PINHD-1X1  [1X01']  55.12,72.9 0 top
OPT4_A  PINHD-1X1  [1X01']  46.48,62.48 0 top
OPT4_B  PINHD-1X1  [1X01']  43.43,69.85 0 top
OPT5_A  PINHD-1X1  [1X01']  54.1,62.99 0 top
OPT5_B  PINHD-1X1  [1X01']  65.79,71.12 0 top
OPT6_A  PINHD-1X1  [1X01']  56.64,62.99 0 top
OPT6_B  PINHD-1X1  [1X01']  57.4,71.63 0 top
OPT7_A  PINHD-1X1  [1X01']  71.12,57.4 0 top
OPT7_B  PINHD-1X1  [1X01']  76.71,71.37 0 top
OPT8_A  PINHD-1X1  [1X01']  73.66,57.4 0 top
OPT8_B  PINHD-1X1  [1X01']  68.58,74.17 0 top
OPT9_A  PINHD-1X1  [1X01']  78.23,57.4 0 top
OPT9_B  PINHD-1X1  [1X01']  89.15,76.2 0 top
OPT10_A  PINHD-1X1  [1X01']  80.77,57.4 0 top
OPT10_B  PINHD-1X1  [1X01']  81.28,77.98 0 top
OPT11_A  PINHD-1X1  [1X01']  86.36,57.4 0 top
OPT11_B  PINHD-1X1  [1X01']  100.33,81.03 0 top
OPT12_A  PINHD-1X1  [1X01']  89.15,57.4 0 top
OPT12_B  PINHD-1X1  [1X01']  92.2,81.28 0 top
PA0  PINHD-1X1  [1X01']  43.43,74.93 0 top
PA1  PINHD-1X1  [1X01']  33.53,76.96 0 top
PA2  PINHD-1X1  [1X01']  55.12,75.44 0 top
PA3  PINHD-1X1  [1X01']  43.43,77.47 0 top
PA4  PINHD-1X1  [1X01']  65.53,76.71 0 top
PA5  PINHD-1X1  [1X01']  57.4,77.72 0 top
PA6  PINHD-1X1  [1X01']  76.71,76.96 0 top
PA7  PINHD-1X1  [1X01']  67.06,80.26 0 top
PB0  PINHD-1X1  [1X01']  88.65,85.34 0 top
PB1  PINHD-1X1  [1X01']  90.93,83.82 0 top
PC4  PINHD-1X1  [1X01']  88.65,82.04 0 top
PC5  PINHD-1X1  [1X01']  81.28,80.01 0 top
Q1  25MHz  [NX3225]  55.63,97.28 180 top
R1  10k  [RESC1608X60]  14.22,103.89 180 bottom
R2  100R  [RESC1608X60]  10.67,97.03 0 bottom
R3  10k  [RESC1608X60]  14.22,95.5 180 bottom
R4  47R  [R0603]  56.64,89.92 180 top
R5  10k  [R0402]  65.02,113.54 90 top
R6  100R  [RESC1608X60]  10.67,88.14 0 bottom
R7  10k  [RESC1608X60]  14.22,87.12 180 bottom
R8  100R  [RESC1608X60]  10.67,79.76 0 bottom
R9  1k  [R0603]  261.62,65.53 180 top
R10  1k  [R0603]  261.62,68.83 180 top
R11  1k  [R0603]  261.62,73.15 180 top
R12  10k  [RESC1608X60]  14.22,78.49 180 bottom
R13  1k  [R0603]  249.43,66.04 90 top
R14  0R_DNP  [R0603]  285.75,61.98 270 top
R15  0R_DNP  [R0603]  288.54,61.98 270 top
R16  100R  [RESC1608X60]  10.67,70.36 0 bottom
R17  10k  [RESC1608X60]  14.48,69.6 180 bottom
R18  100R  [RESC1608X60]  10.41,61.72 0 bottom
R19  10k  [RESC1608X60]  14.22,60.96 180 bottom
R20  100R  [RESC1608X60]  10.16,53.09 0 bottom
R21  10k  [RESC1608X60]  14.22,52.32 180 bottom
R22  100R  [RESC1608X60]  10.16,44.45 0 bottom
R23  10k  [RESC1608X60]  13.97,8.38 180 bottom
R24  100R  [RESC1608X60]  8.13,2.79 0 bottom
R25  10k  [RESC1608X60]  13.97,43.43 180 bottom
R26  100R  [RESC1608X60]  10.67,35.31 0 bottom
R27  10k  [RESC1608X60]  13.97,34.8 180 bottom
R28  100R  [RESC1608X60]  10.67,26.67 0 bottom
R29  10k  [RESC1608X60]  14.22,25.91 180 bottom
R30  100R  [RESC1608X60]  11.68,18.8 0 bottom
R31  10k  [RESC1608X60]  13.97,17.02 180 bottom
R32  100R  [RESC1608X60]  10.67,9.14 0 bottom
R33  20k  [R0603]  36.83,63.25 180 top
R34  20k  [R0603]  35.56,68.58 90 top
R35  820R  [R0603]  37.85,65.28 180 top
R36  820R  [R0603]  40.64,67.06 90 top
R37  0R  [R0603]  41.15,73.91 270 top
R38  20k  [R0603]  38.86,78.99 270 top
R39  20k  [R0603]  39.37,83.06 0 top
R40  820R  [R0603]  41.15,78.99 270 top
R41  820R  [R0603]  35.56,81.53 0 top
R42  0R  [R0603]  33.78,74.17 270 top
R43  100k  [R0603]  35.05,93.47 90 top
R44  100k  [R0603]  35.05,89.92 90 top
R45  20k  [R0603]  45.72,66.04 0 top
R46  20k  [R0603]  51.05,64.26 180 top
R47  820R  [R0603]  45.97,68.83 90 top
R48  820R  [R0603]  51.82,69.09 270 top
R49  0R  [R0603]  52.83,73.91 270 top
R50  20k  [R0603]  46.99,81.28 0 top
R51  20k  [R0603]  51.05,82.3 180 top
R52  820R  [R0603]  51.56,79.25 270 top
R53  820R  [R0603]  54.1,78.49 270 top
R54  0R  [R0603]  45.72,73.91 270 top
R55  20k  [R0603]  58.42,68.83 90 top
R56  20k  [R0603]  63.25,68.58 90 top
R57  820R  [R0603]  56.13,68.83 90 top
R58  820R  [R0603]  59.94,64.26 0 top
R59  0R  [R0603]  65.02,73.91 270 top
R60  20k  [R0603]  64.52,64.26 0 top
R61  20k  [R0603]  63.25,79.5 270 top
R62  33R  [R0201]  57.4,108.2 0 top
R63  820R  [R0603]  60.96,82.55 0 top
R64  820R  [R0603]  58.42,80.26 90 top
R65  0R  [R0603]  57.66,74.68 270 top
R66  20k  [R0603]  71.63,64.52 0 top
R67  20k  [R0603]  70.87,67.56 90 top
R68  820R  [R0603]  76.45,67.06 180 top
R69  820R  [R0603]  76.2,69.09 0 top
R70  0R  [R0603]  75.95,74.17 270 top
R71  20k  [R0603]  77.72,65.02 0 top
R72  20k  [R0603]  74.17,79.76 270 top
R73  820R  [R0603]  76.45,79.76 270 top
R74  820R  [R0603]  70.61,79.5 90 top
R75  0R  [R0603]  68.33,76.96 270 top
R76  20k  [R0603]  81.28,61.98 0 top
R77  20k  [R0603]  87.12,65.02 180 top
R78  820R  [R0603]  81.79,68.83 90 top
R79  560R  [R0603]  67.06,113.03 90 top
R80  820R  [R0603]  81.79,65.53 90 top
R81  33R  [R0201]  57.4,106.17 0 top
R82  0R  [R0603]  53.85,106.93 180 top
R83  33R  [R0201]  57.4,107.19 0 top
R84  33R  [R0201]  57.4,105.16 0 top
R85  0R  [R0603]  89.15,78.99 270 top
R86  0R_DNP  [R0603]  53.85,104.9 180 top
R87  0R_DNP  [R0603]  53.85,108.97 180 top
R88  20k  [R0603]  86.36,62.23 0 top
R89  20k  [R0603]  86.87,79.5 270 top
R90  820R  [R0603]  80.77,73.15 0 top
R91  820R  [R0603]  78.99,76.96 270 top
R92  0R  [R0603]  83.31,79.25 270 top
R93  20k  [R0603]  91.95,66.29 0 top
R94  20k  [R0603]  95,68.83 90 top
R95  820R  [R0603]  95,65.02 90 top
R96  820R  [R0603]  98.04,64.01 0 top
R97  0R  [R0603]  100.33,83.82 270 top
R98  20k  [R0603]  96.01,60.96 0 top
R99  20k  [R0603]  91.44,73.66 270 top
R100  820R  [R0603]  98.81,79.76 270 top
R101  820R  [R0603]  95,79.76 90 top
R102  0R  [R0603]  93.73,85.34 0 top
R103  0R  [R0603]  44.7,100.08 270 top
R104  560R  [R0603]  50.55,111.25 0 top
R105  33R  [R0402]  70.1,115.32 90 top
R106  33R  [R0402]  71.37,115.32 90 top
R107  33R  [R0402]  73.91,114.55 270 top
R108  0R_DNP  [R0603]  55.12,102.87 180 top
R109  33R  [R0402]  72.64,114.55 90 top
R110  0R  [R0603]  283.46,61.98 270 top
R111  0R  [R0603]  290.83,61.98 270 top
R112  0R  [R0603]  289.81,59.44 180 top
R113  10k  [R0603]  179.32,49.53 270 top
R114  10k  [R0603]  183.13,52.83 270 top
R115  10k  [R0603]  164.34,49.53 0 top
R128  5.1k  [R0603]  -22.86,-34.29 0 top  (outside the outline)
R129  5.1k  [R0603]  -33.78,-39.88 0 top  (outside the outline)
S1  MOMENTARY-SWITCH-SPST-PTH-6.0MM  [TACTILE_SWITCH_PTH_6.0MM]  91.72,208.97 0 bottom  (outside the outline)
S2  MOMENTARY-SWITCH-SPST-PTH-6.0MM  [TACTILE_SWITCH_PTH_6.0MM]  75.54,216.94 0 bottom  (outside the outline)
S3  MOMENTARY-SWITCH-SPST-PTH-6.0MM  [TACTILE_SWITCH_PTH_6.0MM]  57.1,221.97 0 bottom  (outside the outline)
S4  MOMENTARY-SWITCH-SPST-PTH-6.0MM  [TACTILE_SWITCH_PTH_6.0MM]  36.8,221.03 0 bottom  (outside the outline)
S5  MOMENTARY-SWITCH-SPST-PTH-6.0MM  [TACTILE_SWITCH_PTH_6.0MM]  142.21,231.65 0 bottom  (outside the outline)
S6  MOMENTARY-SWITCH-SPST-PTH-6.0MM  [TACTILE_SWITCH_PTH_6.0MM]  142.49,218.34 0 bottom  (outside the outline)
S7  MOMENTARY-SWITCH-SPST-PTH-6.0MM  [TACTILE_SWITCH_PTH_6.0MM]  137.26,224.92 0 bottom  (outside the outline)
S8  MOMENTARY-SWITCH-SPST-PTH-6.0MM  [TACTILE_SWITCH_PTH_6.0MM]  147.4,224.97 0 bottom  (outside the outline)
S9  MOMENTARY-SWITCH-SPST-PTH-6.0MM  [TACTILE_SWITCH_PTH_6.0MM]  154.28,242.95 0 bottom  (outside the outline)
S10  MOMENTARY-SWITCH-SPST-PTH-6.0MM  [TACTILE_SWITCH_PTH_6.0MM]  117.78,211.12 0 bottom  (outside the outline)
S11  MOMENTARY-SWITCH-SPST-PTH-6.0MM  [TACTILE_SWITCH_PTH_6.0MM]  113.82,222.28 0 bottom  (outside the outline)
U1  CY8C5868AXI-LP035  [TQFP-100-14X14MM]  171.2,59.69 270 top
U2  CY8C5868AXI-LP035  [TQFP-100-14X14MM]  134.14,138.2 0 top
U3  [QRE1113]  12.45,100.58 90 bottom
U4  [QRE1113]  12.45,91.95 90 bottom
U5  [QRE1113]  12.45,83.31 90 bottom
U6  [QRE1113]  12.45,74.42 90 bottom
U7  [QRE1113]  12.45,65.79 90 bottom
U8  [QRE1113]  12.45,56.9 90 bottom
U9  [QRE1113]  12.45,48.26 90 bottom
U10  [QRE1113]  12.45,39.37 90 bottom
U11  [QRE1113]  12.45,30.73 90 bottom
U12  [QRE1113]  12.45,22.1 90 bottom
U13  [QRE1113]  12.19,13.21 90 bottom
U14  [QRE1113]  12.19,4.57 90 bottom
U15  R-78E5.0-1.0  [DC-DC_CONVERTER_78XX]  81.53,124.97 0 top
U16  TEXAS_TPS2051B  [TEXAS_SOT23-5]  7.87,12.45 0 bottom
U17  R-78E5.0-1.0  [DC-DC_CONVERTER_78XX]  327.15,67.82 90 top
U18  R-78E5.0-1.0  [DC-DC_CONVERTER_78XX]  316.23,67.56 90 top
U$1  RK09  [RK09]  79.25,241.55 0 bottom  (outside the outline)
U$2  RK09  [RK09]  42.16,242.06 0 bottom  (outside the outline)
U$3  CMR0512S3C  [CMR0512S3C]  293.12,72.39 0 top
U$5  SS-7188VS-A-FLS  [SS-7188VS-A-FLS_RJ45]  260.86,233.43 0 top  (outside the outline)
U$6  SS-7188VS-A-FLS  [SS-7188VS-A-FLS_RJ45]  284.73,231.9 0 top  (outside the outline)
VREGGND  PINHD-1X1  [1X01']  288.29,64.77 90 top
VREGIN  PINHD-1X1  [1X01']  285.75,64.77 90 top
X1  3221-10-0300-00  [3221-10-0300-00]  112.01,150.62 0 top
X2  3221-10-0300-00  [3221-10-0300-00]  95.5,106.17 180 top
X3  3221-10-0300-00  [3221-10-0300-00]  153.92,66.55 180 top
X6  2520-  [PAK100/2500-20]  205.99,58.17 90 top
X7  2520-  [PAK100/2500-20]  191.26,58.17 270 top

## Tracks (layer width: path | path; a pad name or v marks a point on that pad's centre or on a via)
3V3  (via drill 0.35)
  Top 0.305: C99.1 IC7.4 61.47,73.41 v60.57,74.31 | C101.1 72.39,69.74 IC8.4 v72.39,72.9 | C103.1 IC9.4 v85.09,72.9 | C105.1 IC10.4 v96.77,72.64 | C41.1 IC1.4 49.28,72.26 49.15,72.39 v49.15,72.64 | C45.1 IC17.4 v37.59,72.39
  Top 0.61: R43.2 35.25,94.12 | C43.1 37.2,93.55 IC4.5 36.9,93.91 36.58,94.23 36.46,94.12
  Top 0.813: 36.46,94.12 36.46,94.49 35.05,94.49 | 35.05,94.49 R43.2 | C31.1 33.42,94.12 33.78,94.49 35.05,94.49
  Top 1.27: IC4.5 36.9,93.76 36.32,94.34 36.32,95 v35.81,95.5
  Route15 0.305: 96.39,72.26 v96.77,72.64 | 72.39,72.39 v72.39,72.9 | 49.28,71.88 49.15,72.01 v49.15,72.64
  Route15 0.508: 65.02,73.66 62.43,73.66 62.33,73.56 61.31,73.56 v60.57,74.31
  Route15 1.27: v35.81,95.5 33.02,92.71 33.02,79.25 31.5,77.72 31.5,75.95 34.57,72.87 34.57,72.64 35.3,71.91 35.53,71.91 36.07,71.37 36.07,71.12 36.58,71.12 37.85,72.39 39.4,70.84 39.4,69.34 40.92,67.82 45.21,67.82 49.28,71.88 | 49.28,71.88 49.28,72.64 | 49.28,71.88 53.09,71.88 56.9,68.07 56.9,66.04 61.72,61.21 JP2.14 | 65.02,73.66 65.54,73.66 66.81,72.39 72.39,72.39 75.69,69.09 79.5,69.09 83.31,72.9 v85.09,72.9 85.12,72.87 85.12,72.64 86.38,71.37 95.5,71.37 96.39,72.26
  pour Route15 (isolate 0.813): 29.46,100.58 46.23,100.58 46.23,93.47 66.8,93.47 70.61,89.66 70.61,86.11 74.17,82.55 83.06,82.55 87.38,86.87 100.84,86.87 103.12,84.58 103.12,54.1 29.97,54.1 29.46,54.61
3V3A
  Top 0.254: C65.1 58.65,91.69 59.01,92.06 IC3.33 | 40.64,99.29 C116.1 | C116.1 40.39,99.06 40.39,98.81
  Top 0.305: 40.52,98.94 40.64,99.06 40.64,99.29
  Top 0.406: IC11.1 41.1,98.94 40.52,98.94 40.39,98.81 40.27,98.92 C113.1
  Top 0.61: R4.1 57.49,91.67 C65.1 57.52,89.53 56.13,88.14 55.63,88.14
  Top 0.813: C113.1 39.62,98.3
  Top 1.016: C110.1 37.76,98.3 39.62,98.3 40.39,98.3 | 55.63,88.14 53.85,88.14 51.56,90.42 51.31,90.42
  Top 1.27: C110.1 37.08,97.96 37.08,97.79 35.43,97.79 C111.1 32.36,97.91 C112.+ | 41.66,96.52 3V3A.1
  Top 1.905: 3V3A.1 40.39,98.3
  Top 2.54: 41.66,96.52 41.66,94.74 42.67,93.73 45.21,93.73 45.36,93.58 D3.A 49.02,92.71 51.31,90.42
3V3A2  (via drill 0.65)
  Top 0.254: C124.1 173.59,49.4 173.21,49.78 | U1.65 172.2,51.68 172.2,50.79 173.21,49.78 | 173.21,49.78 v175.01,49.78
  Top 1.016: C124.1 175.01,47.61 175.01,46.76 C125.1 | IC18.2 149.22,50.04 151.24,50.04 C152.1 152.01,50.52 C153.1 158.52,50.52 159.77,49.28 3V3A_2.1
  Top 1.27: 144.27,50.04 149.22,50.04
  Top 2.54: IC18.PAD 142.9,51.16 142.75,51.31 145.8,51.31 145.8,46.74 139.7,46.74 139.7,49.78 141.48,51.56 142.24,51.56 142.24,48.51 141.99,48.26 144.27,48.26 144.27,50.04 | C153.1 153.67,52.07 148.84,56.9 | 148.84,56.9 146.56,56.9 | 148.84,56.9 152.91,56.9 152.91,53.09
  pour Route15 (no thermals): 138.18,44.96 138.43,45.21 138.43,50.55 146.05,58.17 164.59,58.17 167.13,55.63 187.71,55.63 187.71,70.36 194.31,70.36 194.31,44.96
3V3D2  (via drill 0.65)
  Top 0.254: U1.75 178.83,51.69 C133.1 178.82,52.07 v178.05,52.83 | U1.88 180.76,59.69 C154.1 181.22,60.57 181.89,61.24 v181.89,61.5 | C150.1 179.2,67.3 U1.100 179.1,65.79 177.55,65.79 v177.29,65.53 | U1.26 163.2,66.05 C148.1 | C151.1 161.79,60.71 162.3,60.2 U1.37 164.85,60.19 v165.1,59.94 | C149.1 162.93,53.42 U1.50 163.1,53.59 161.04,53.59 160.99,53.64 v159.26,53.64
  Top 0.813: X3.1 157.13,69.09 v158.5,69.09 | C148.1 163.72,66.69 v164.08,67.06
  Top 1.016: IC20.PAD 134.01,47.9 3V3D2.1 | IC20.2 130.02,56.22 C157.1 129.68,56.39 129.54,56.53 129.54,58.65 C161.1
  Top 1.27: C161.1 128.78,57.89 128.78,57.15 127.76,57.15 v127.76,56.9
  Top 2.54: IC20.PAD 127.86,47.9 125.48,50.29 | 125.48,50.29 125.48,50.8 | 125.48,50.29 125.48,48.26 124.21,46.99 108.2,46.99 107.45,46.24 135.9,46.24 136.14,46.48 136.14,48.77 127.25,48.77
  Route15 0.254: v159.26,53.64 159.26,59.44 159.51,59.69
  Route15 0.813: v178.05,52.83 178.05,57.15 177.8,57.4
  Route15 1.27: v127.76,56.9 128.78,56.9 130.81,54.86
  pour Route15 (no thermals): 105.16,71.63 186.94,71.63 186.94,56.9 167.13,56.9 164.85,59.18 145.8,59.18 137.41,50.8 137.41,45.72 136.91,45.21 106.17,45.21 105.16,46.23
5VD2
  Top 1.016: IC20.3 124.05,54.2 5VD2.1 121.94,52.55 C160.1 117.83,52.58 115.82,52.58 115.32,52.07 C156.1 113.16,53.58 J16.2 J16.1
  Top 1.27: IC20.3 127.74,52.09 128.52,51.31 136.14,51.31 139.19,54.36 147.19,54.36 IC18.3
+1.8V  (via drill 0.35)
  Top 0.254: C73.2 C100.1 61.67,80.35 R61.1 | v92.69,74.26 91.69,74.26 R99.1
  Top 0.305: C26.2 39.23,63.25 38.61,63.25 | 37.18,84.16 38.28,83.06 R39.1 | C35.2 52.72,65.08 R46.1 | R51.1 52.05,82.44 C39.2 52.9,83.39 52.76,83.39 v52.58,83.57 | 73.73,67.24 73.21,66.71 v72.14,66.71 R67.1 | 73.73,67.24 C77.2 | C101.2 73.59,67.24 73.73,67.24 | R72.1 73.71,80.15 C102.1 72.39,81.42 C81.2 v71.93,82.8 v71.94,82.81 | C103.2 85.6,67.93 C85.2 87.97,67.59 87.97,66.44 | 87.97,66.44 R77.1 | C93.2 96.77,66.91 C105.2 96.38,68.18 96.01,67.82 95.16,67.82 R94.1 95.34,67.98 v96.27,67.06 | 37.41,79.96 37.34,80.04 C46.1 37.34,79.89 37.46,80.01 | 37.34,79.78 37.46,79.66 37.46,80.01 | 37.46,80.01 v37.46,80.67 | v37.63,84.29 37.5,84.16 37.18,84.16 | C29.2 37.14,84.16 37.18,84.16 | C42.1 49.53,80.01 49.11,80.43 v49,80.43 | C73.2 v60.2,81.28 | C62.2 v62.23,66.29 | C104.1 85.54,80.35 R89.1 86.02,80.35 v85.6,80.77 | 87.97,66.44 v87.83,66.3 | C106.1 96.52,80.15 v96.52,80.77 | C97.2 93.22,74.79 v92.69,74.26 | C89.2 79.39,80.66 v80.01,81.28
  Top 0.406: R56.1 63.05,67.93 61.72,67.93 C99.2 61.47,66.66 C62.2 | C45.2 37.59,66.8 v37.34,66.8 | IC4.4 38.8,90.93 IC4.3 | C35.2 52.72,66.94 v52.83,67.06 | C41.2 50.18,68.44 v50.29,68.33
  Top 0.61: IC4.3 38.94,90.5 39.51,90.5 C44.1 | C43.2 38.8,94.44 IC4.4 | C44.1 39.51,90.93 38.8,90.93 | C44.1 39.62,88.65 39.62,91.69 | R33.1 38.61,63.25 v38.61,62.23
  Top 1.27: 39.62,91.69 v39.88,91.69
  Route2 0.406: v37.34,66.8 37.34,66.55
  Route2 1.27: v39.88,91.69 39.88,83.31
  pour Route2 (isolate 0.813): 29.97,53.59 102.87,53.59 102.87,84.84 51.31,85.34 50.55,85.34 42.67,93.22 38.35,93.22 29.97,84.84
+3V3  (via drill 0.35, 0.65)
  Top 0.254: IC3.52 69.61,87.55 69.59,87.53 C8.1 69.99,86.72 | IC3.62 74.61,87.01 C6.1 75.33,86.29 C13.1 | IC3.72 79.76,88.49 79.76,88.14 | C67.1 83.32,96.06 | 83.32,96.06 IC3.84 | 83.32,96.06 83.62,96.06 84.07,96.52 84.72,96.52 C12.1 | IC3.95 82.04,101.56 82.44,101.56 82.48,101.6 C66.1 83.56,101.6 83.96,102 C11.1 | IC3.108 81.56,108.08 82.93,108.08 C7.1 83.97,108.85 C63.1 | IC3.121 73.62,111.08 73.66,111.13 C68.1 73.66,112.16 74.03,112.52 C20.1 | IC3.131 C69.1 68.63,111.52 68.63,111.83 68.95,112.15 C55.1 | C4.1 61.98,110.13 IC3.144 IC3.143 | IC3.17 59.28,100.07 59.27,100.08 C9.1 58.27,99.93 C2.1 | C14.1 63.75,86.22 63.75,86.61 63.65,86.61 C10.1 63.13,87.16 63.13,87.59 63.11,87.61 IC3.39 63.12,89.54 63.25,89.67 63.25,93.73 v62.23,94.74 62.23,94.49 61.67,93.93 61.57,93.93 61.21,93.56 IC3.30 | C1.1 69.99,86.72 | 69.99,86.72 71.27,86.72 v71.88,86.11 | IC3.6 61.88,105.56 v62.23,105.92
  Top 0.305: IC11.4 42.81,101.97 42.16,102.62 39.37,102.62 38.35,103.63 38.35,106.2
  Top 0.406: 79.76,88.14 79.87,88.14 C3.1
  Top 0.508: C2.1 58.28,99.06 58.67,99.06 v58.42,98.81
  Top 0.61: 75.33,86.29 76.27,86.29 76.45,86.11 v76.71,86.11 | 79.76,88.14 v81.28,88.14 | 84.07,96.52 83.82,96.77 v83.82,97.03 | 83.96,102 83.82,102.14 v83.82,103.12 | C63.1 83.68,108.85 v83.31,109.22 | v75.44,114.05 75.44,113.93 74.79,113.28 C20.1 | C55.1 68.58,113.14 v68.58,113.79 | IC3.144 61.62,110.49 v60.96,110.49
  Top 0.813: X2.1 v98.04,110.24
  Top 1.016: IC12.2 41.82,106.77 C107.1 45.42,106.77 C108.1 48.16,107.06 C109.+ 49.78,107.16 | 49.78,107.16 50.82,107.16 3V3D.1 | R104.1 49.7,107.25 49.78,107.16
  Top 1.27: D3.C 52.21,100.98 v52.32,101.09
  Top 1.905: IC12.2 38.35,106.2 34.98,106.2 IC12.PAD
  other vias: 38.1,106.17
  pour Route15 (isolate 0.813): 29.21,118.62 29.21,101.35 46.99,101.35 46.99,94.23 67.06,94.23 71.37,89.92 71.37,86.61 74.68,83.31 82.8,83.31 87.12,87.63 101.09,87.63 103.12,89.66 103.12,119.13 102.62,118.62
+5V
  Top 0.406: IC11.6 41.22,101.6 41.15,101.6
  Top 0.508: 41.15,101.6 40.89,101.85 38.86,101.85
  Top 0.61: 38.86,101.85 38.61,102.11 37.08,102.11
  Top 0.813: 37.08,102.11 36.32,102.87
  Top 1.016: IC12.3 41.66,108.89 5V.1 44.07,111.76 C114.1 46.89,111.63 C115.+
  Top 1.27: 36.32,102.87 33.02,102.87 32,103.89 32,108.97 33.27,110.24 | 41.4,110.24 41.66,110.49
  Top 2.54: 33.27,110.24 41.4,110.24 | 41.66,110.49 5V.1
+5V/1  (via drill 0.35)
  Top 0.254: C117.1 330.6,71.26 C119.1
  Top 0.406: 330.6,71.26 330.26,70.92 327.71,70.92
  Top 0.61: U17.VOUT 327.71,70.92
  Top 0.813: R14.2 285.75,60.71 284.48,59.44 v282.45,59.44
  Route15 0.813: v282.45,59.44 285.5,56.39 304.29,56.39 311.15,63.25 310.64,63.75 310.64,64.77 309.88,65.53 5V/1.1
  pour Route15: 328.68,73.15 318.01,73.15 294.13,49.28 294.13,34.8 295.66,33.27 393.95,33.27 398.02,37.34 398.02,65.79 400.05,67.82 431.04,67.82 434.34,71.12 434.34,121.16 432.56,122.94 389.89,122.94 371.86,104.9 371.86,87.38 357.38,72.9 328.93,72.9
+9V
  Top 0.203: C58.1 254.02,69.07 254.02,68.77 254.36,68.43 | 253.49,68.83 253.95,68.83 253.95,68.73
  Top 0.254: 254.36,68.43 254.51,68.28 | C47.1 272.18,75.44 C51.1
  Top 0.406: C56.1 252.59,69.74 253.49,68.83 | 253.95,68.73 254.25,68.43 254.36,68.43
  Top 0.508: 254.51,68.28 254.51,65.79 254.15,65.43 252.69,65.43 IC2.7
  Top 0.61: IC5.OUT 274.21,75.04 C47.1
  Top 0.813: 252.73,71.63 252.73,70.25 C56.1
  Top 1.27: C47.1 256.14,75.04 252.73,71.63
+12V  (1 unrouted)
  Top 0.203: C120.1 330.28,65.28 330.28,65.02
  Top 0.254: C120.1 329.92,65.03
  Top 0.406: C118.1 331.33,65.02 330.46,65.02 | 330.46,65.02 330.28,65.02 | 330.46,65.02 330.28,65.2 329.69,65.2
  Top 0.813: 329.92,65.03 327.4,65.03 U17.VIN
  Top 1.27: U17.VIN 326.9,65.02 U18.VIN
  Route2 1.27: JP15.1 329.18,63.25 U17.VIN
-9V  (via drill 0.35)
  Top 0.254: C59.2 257.42,67.95 IC2.4 | 277.51,67.56 C52.2
  Top 0.406: C57.2 257.7,68.22 257.42,67.95
  Top 0.61: IC6.OUT 277.51,69.23 277.51,67.56 C48.2
  Top 0.813: IC2.4 257.87,68.89 v259.33,70.36
  Bottom 1.27: v259.33,70.36 271.02,70.36 274.07,67.31 277.37,67.31 278.13,68.07 IC6.OUT
AGND  (via drill 0.3, 0.35)
  Top 0.254: C64.2 56.73,92.94 | 56.22,92.94 C65.2 | IC3.31 61.64,93.06 | 61.85,93.27 61.9,93.22 | C106.2 IC10.11 | C116.2 40.39,100.07
  Top 0.305: C100.2 IC7.11 61.47,75.69 v61.21,75.44 | C102.2 IC8.11 72.39,75.18 72.14,74.93 v72.14,75.18 | C104.2 IC9.11 v85.09,74.93 | C46.2 37.59,77.84 IC17.11 v37.59,74.87 | v96.67,75.69 96.77,75.79 IC10.11 | IC1.11 49.28,77.98 49.53,77.98 C42.2 49.43,77.99 v48.41,77.99 | C113.2 39.77,100.07 40.39,100.07 40.64,100.33 41.91,100.33 IC11.PAD 42.93,100.33 44.03,99.23 R103.2
  Top 0.406: IC11.5 IC11.PAD | 40.64,100.08 40.77,100.08 40.77,100.58
  Top 0.61: 61.64,93.06 61.85,93.27 | 61.9,93.22 v62.23,93.22 | IC4.2 37.85,89.01 C44.2 37.59,89.27 37.59,89.07 R44.1 | C32.2 32.4,89.52 32.26,89.66 32,89.66
  Top 0.813: v54.86,92.2 55.6,92.94 56.22,92.94 56.73,92.94 | C32.2 33.16,89.52 33.53,89.15 34.96,89.15 R44.1 | C110.2 37.65,100.22 C113.2 40.5,100.22 40.64,100.08 | 41.91,100.33 41.02,100.33 v40.72,100.64 40.77,100.58
  Top 1.016: 32,89.66 v31.5,89.66 | R103.2 44.7,97.03 AGND.1
  Top 1.27: C44.2 37.96,88.39 v36.83,88.39 | C110.2 37.17,100.58 35.44,100.58 C111.2 32.36,100.71 C112.-
  Route2 0.254: 55.12,92.2 v54.86,92.2
  Route2 1.27: v62.23,93.22 61.21,92.2 55.12,92.2
  Route15 0.305: 96.77,75.69 v96.67,75.69 | 84.84,75.44 85.09,75.18 v85.09,74.93 | v61.21,75.44 60.71,75.44 60.32,75.82 | 48.41,77.72 v48.41,77.99 | 37.59,74.93 v37.59,74.87
  Route15 1.27: v36.83,88.39 35.05,86.61 35.05,80.77 37.59,78.23 37.59,74.93 38.86,76.2 41.15,76.2 41.15,78.49 43.69,81.03 46.48,81.03 49.02,78.49 49.53,78.49 50.29,77.72 | 48.41,77.72 50.29,77.72 | 50.29,77.72 51.56,77.72 52.32,78.49 53.85,78.49 55.12,79.76 59.94,79.76 61.47,78.23 61.47,76.96 | 61.47,76.96 61.47,76.2 64.26,78.99 64.26,80.52 68.07,84.33 74.42,84.33 75.18,83.57 75.18,80.52 72.14,77.47 v72.14,75.18 72.67,75.72 72.67,75.95 75.71,78.99 78.49,78.99 79.65,77.83 79.65,77.31 80.76,76.2 85.6,76.2 | 84.84,75.44 85.6,76.2 | 85.6,76.2 87.38,77.98 94.49,77.98 96.77,75.69 | JP2.15 JP2.13 64.77,57.4 66.29,58.93 66.29,60.96 64.52,62.74 64.52,66.29 61.72,69.09 59.18,69.09 58.93,69.34 58.93,70.85 59.03,70.95 59.03,72.3 58.93,72.4 58.93,74.42 60.32,75.82 61.47,76.96
  pour Route2 (isolate 0.813): 29.21,102.11 29.21,86.61 37.34,94.74 43.43,94.74 51.31,86.87 69.34,86.87 70.87,88.39 70.87,91.69 68.07,94.49 49.02,94.49 43.43,100.08 43.43,100.33 42.93,100.84 33.53,100.84 32.51,101.85 32.51,102.11
AGND2  (via drill 0.65)
  Top 0.254: U1.64 171.7,49.17 C124.2 171.84,48.51 171.68,48.51 171.44,48.76 | C125.2 171.84,46.87 | 170.42,48.76 v170.45,48.76 170.93,48.76
  Top 0.61: C163.2 157.5,55.12 v156.21,55.12
  Top 1.016: IC18.1 151.01,47.78 C152.2 152.01,47.52 C153.2 156.23,47.52 AGND_2.1 | 171.84,46.87 171.84,48.51 | 171.44,48.76 170.93,48.76 | 170.42,48.76 169.9,48.24 C126.2
  pour Route2 (no thermals): 137.41,44.2 138.43,45.21 138.43,50.55 146.05,58.17 164.59,58.17 166.88,55.88 187.71,55.88 187.71,71.63 195.33,71.63 195.33,44.2
AGND5  (via drill 0.35)
  Top 0.203: C58.2 254.5,69.49 | C59.1 255.78,69.49
  Top 0.254: 296.37,74.27 296.37,74.17 | 296.37,74.17 295.66,74.17 C54.1 | C53.2 296.37,74.17 | 273.54,76.34 273.14,75.94 C51.2 272.54,76.2 272.54,76.34 | C52.1 276.21,67.96
  Top 0.305: 254.5,69.49 C56.2 | 255.78,69.49 C57.1
  Top 0.406: 296.53,74.93 296.68,74.78 296.68,74.58 296.37,74.27
  Top 0.508: IC2.3 256.16,66.68 v256.03,66.8
  Top 0.61: IC6.GND 275.59,69.09 276.21,68.47 276.21,67.96 C48.1 | C47.2 272.54,76.34 273.54,76.34 274.55,76.34 274.59,76.38 276.05,76.38 IC5.GND | U$3.P$4 295.66,74.17 295.66,74.93 | 295.66,74.93 295.29,74.93 C49.1 | 295.66,74.93 296.53,74.93 C50.2
  Top 0.813: C57.1 C56.2 v255.02,70.1 255.16,70.1
  Route2 1.016: JP4.6 JP4.5 JP4.3 | JP4.4 JP4.6 | JP4.6 324.36,34.8 323.34,37.08 323.34,38.86 325.88,41.15 325.88,48.51 316.48,57.91 298.96,57.91
  Route2 1.27: U$3.P$4 295.66,67.06 290.07,61.47 283.72,61.47 283.72,57.15 283.97,56.9 297.94,56.9 298.96,57.91
  pour Route2 (isolate 0.508): 242.57,75.95 242.57,45.97 241.81,45.21 241.81,10.41 246.38,5.84 258.83,5.84 262.89,9.91 262.89,48.51 264.92,50.55 289.05,50.55 312.67,74.17 356.36,74.17 370.08,87.88 370.08,107.44 365.76,111.76 361.95,111.76 355.6,105.41 355.6,86.61 347.73,78.74 256.82,78.74 246.13,79.5
BAR_STRING1  (via drill 3.17 pad 7.11)  (3 unrouted)
  other vias: 217.07,100.65 228,77.79 228,71.18 228,64.83
BAR_STRING2  (via drill 3.17 pad 7.11)  (2 unrouted)
  other vias: 228,56.71 228,50.36 228,43.75
BAR_STRING3  (via drill 3.17 pad 7.11)  (2 unrouted)
  other vias: 227.74,23.94 227.74,17.59 227.74,10.99
BOTTOMWIPER1
  Top 0.254: U1.77 182.63,54.19 R114.1
BOTTOMWIPER2
  Top 0.254: U1.78 184.58,54.69 186.18,53.09 186.18,50.04 186.94,49.28 X7.17
CGND  (via drill 0.35)
  Bottom 0.508: U16.2 v7.87,12.45
  Bottom 0.61: U3.2 11.55,103.63 v10.41,103.63 | U3.4 15.24,98.78 15.24,98.81 v15.36,98.81 | U4.2 11.55,94.49 v10.41,94.49 | U4.4 13.35,89.66 v14.99,89.66 | U5.2 11.55,85.6 v9.91,85.6 | U5.4 13.35,80.77 v14.73,80.77 | U6.2 11.55,77.22 v9.91,77.22 | U6.4 14.99,72.62 v14.99,72.39 | U7.2 11.55,68.33 v9.91,68.33 | U7.4 13.35,63.25 v14.73,63.25 | U8.2 11.55,59.44 v10.41,59.44 | U8.4 13.35,54.36 v14.48,54.36 14.73,54.36 | U9.2 11.55,51.05 v10.16,51.05 | U9.4 14.73,46.46 v14.73,46.23 | U10.2 11.55,41.91 v10.41,41.91 | U10.4 13.35,37.08 v14.99,37.08 | U11.2 11.55,33.53 v10.67,33.53 | U11.4 13.35,28.19 v14.48,28.19 | U12.2 11.55,24.38 v10.16,24.38 | U12.4 13.35,19.81 v14.73,19.81 14.99,19.81 | U13.2 11.29,16.26 v10.41,16.26 | U13.4 13.09,10.92 v14.48,10.92 | U14.2 11.29,6.6 v9.91,6.6 | U14.4 13.09,4.32 12.95,4.32 12.95,4.57 v12.19,4.57
  Bottom 0.813: C21.2 9.26,17.41 v10.41,16.26 | C15.2 C16.2 6.46,8.64 v5.84,8.64 6.1,8.64
  Bottom 1.016: C22.2 9.26,17.41
  pour Route2: 0,106.17 16.76,106.17 16.76,0 0,0
CMOD
  Top 0.254: U1.93 180.44,62.19 C155.1
DGND  (via drill 0.35, 0.65)
  Top 0.254: C1.2 68.69,86.72 C8.2 69.09,87.71 69.11,87.73 IC3.51 69.12,89.94 70.36,91.19 v72.9,91.19 | C13.2 74.12,85.95 C6.2 74.11,87.01 IC3.61 74.12,90.37 v74.17,90.42 | IC3.83 83.32,95.56 C67.2 83.49,95.58 84.07,95 84.72,95 C12.2 | IC3.94 83.28,101.06 | 83.28,101.06 C66.2 | 83.28,101.06 83.76,100.58 84.47,100.58 C11.2 | C63.2 84.47,107.45 C7.2 83.04,107.46 82.74,107.46 82.64,107.56 IC3.107 80.4,107.56 v80.16,107.8 | IC3.120 74.12,110.9 74.16,110.94 C68.2 75.69,111.51 76.09,111.91 C20.2 | C69.2 | C69.2 IC3.130 | C69.2 70.25,112.64 C55.2 | LED2.C 65.02,115.3 R5.2 63.54,114.09 62.88,113.43 C4.2 | IC3.16 59.28,100.57 59.27,100.58 C9.2 57.77,101.23 C2.2 | IC3.38 C10.2 62.61,86.75 62.34,86.47 C14.2 | 54.01,100.5 54.75,101.23 v55.88,101.23 | Q1.4 56.76,96.52 58.17,96.52 v58.18,96.54
  Top 0.305: C10.2 61.75,87.15 v61.72,87.12
  Top 0.406: C2.2 v55.88,101.23 | 54.01,100.5 C17.2 54.01,98.59 Q1.2 | Q1.4 56.48,96.23 C18.2
  Top 0.61: C5.2 90.79,102.11 v89.92,102.11 | C11.2 85.49,100.7 85.6,100.58 v85.85,100.58 | C12.2 84.95,95 v86.36,95 | C3.2 83.13,87.05 83.96,87.88 v84.07,87.88 | R5.2 64.05,115.06 v64.01,115.06 | v77.22,112.52 C20.2 | 70.25,112.64 70.36,112.53 v70.36,111.76
  Top 0.813: X2.5 X2.3 96.01,108.8 96.01,110.24 v95.5,110.74 | v92.71,110.49 92.96,110.24 X2.9
  Top 1.016: IC12.1 42.95,103.91 43.43,104.39 | 43.43,104.39 C107.2 | 43.43,104.39 45.97,104.39 46.23,104.14 | 46.23,104.14 45.84,104.14 C108.2 | 46.23,104.14 48.24,104.14 C109.- 50.82,104.16 DGND.1 | 44.7,102.62 R103.1 | C19.2 80.64,83.44 82.04,84.84 82.8,84.84 83.13,85.16 83.13,87.05 | C115.- 44.3,114.53 C114.2 41.79,114.43 DGND1.1 | LED1.C 52.08,113.27 52.07,113.28 v51.82,113.28
  Top 1.27: 44.2,103.63 44.45,103.63 | 44.45,103.63 45.09,103.63 C108.2 | 44.45,103.63 44.45,102.87 44.7,102.62
  Top 2.54: v43.94,103.63 44.2,103.63
  Route2 0.254: v74.17,90.42 73.66,90.42 v72.9,91.19
  Route2 0.813: v95.5,110.74 92.96,110.74 v92.71,110.49
  Bottom 0.305: v61.72,87.12 63.25,88.65 63.25,96.01 v63.75,96.52
  pour Route2 (isolate 0.813): 28.96,118.87 28.96,103.12 43.18,103.12 50.29,96.01 68.83,96.01 72.39,92.46 72.39,86.61 102.87,86.61 103.12,86.36 103.12,118.87
DGND2  (via drill 0.65)  (1 unrouted)
  Top 0.254: C132.2 184.38,58.05 182.68,59.75 | C154.2 183.02,60.09 182.68,59.75 | C151.2 159.65,60.45 160.41,59.7 161.48,59.7 161.49,59.69 U1.38 | U1.87 182.13,59.19 182.68,59.75 | U1.14 U1.13 U1.12 | C150.2 v182.37,67.31 | C133.2 180.96,53.2 181.1,53.34 v181.1,53.31 | U1.66 172.7,53.57 v176.02,56.9
  Top 0.61: C149.2 160.92,52.58 156.21,52.58 154.94,53.85 154.94,57.4 155.7,58.17 C131.2 157.76,59.46 158.12,59.82 v157.99,59.94 158.89,59.94 C151.2
  Top 0.813: X3.3 X3.5 X3.7 X3.9 151.29,68.33 v149.86,68.33 | C148.2 163.94,68.44 v164.08,68.58 | U1.13 v171.2,66.04 171.2,65.79 | IC20.1 133.1,54.99 133.1,56.64 | C155.2 183.89,61.59 183.89,61.07 C154.2
  Top 1.016: DGND3.1 118.09,49.78 C160.2 117.74,49.67 C156.2 111.6,49.67 | 111.6,49.67 J16.4 | C161.2 132.56,57.01 C157.2 132.31,56.02 IC20.1 | J16.3 111.6,51.48 111.6,49.67 | C132.2 185.4,56.64 v185.67,56.64
  Top 2.54: 133.1,56.64 v134.11,56.64 134.37,56.64
  Route2 0.61: v157.99,59.94 159,59.94 159.51,60.45
  Bottom 1.016: v185.67,56.64 184.44,56.64 v181.1,53.31
  other vias: 184.15,61.59
  pour Route2 (no thermals): 105.16,71.63 186.69,71.63 186.69,56.9 167.13,56.9 164.85,59.18 145.8,59.18 137.67,51.05 137.67,45.72 135.89,43.94 105.16,43.94
DGND5  (via drill 0.35)
  Top 0.203: C119.2 330.45,70.11 | 330.6,66.18 330.26,65.84 330.2,65.84 329.72,66.32 | 330.62,66.2 330.28,65.87 330.2,65.87 | C120.2 330.07,65.98
  Top 0.254: 331.32,70.11 330.45,70.11 | 330.07,65.98 330.07,66.68
  Top 0.406: 331.32,70.11 C117.2 | C118.2 330.6,66.18 | 329.72,66.32 329.21,66.83 328.22,67.82 328.17,67.82
  Top 0.61: C123.2 v319.53,62.74
  Top 1.016: 328.22,67.82 329.33,67.82 C117.2 331.47,68.58 | 331.47,68.58 331.47,68.07 | 331.47,68.07 330.07,66.68 329.72,66.32 | 331.47,68.58 329.72,66.83 329.21,66.83 | 328.17,67.82 U17.GND | 331.47,68.07 331.47,66.8 330.85,66.18 330.63,66.18 330.62,66.2 | R15.2 288.54,59.86 R112.2
  Top 1.27: R112.2 v286.77,59.44
  Route2 1.27: v286.77,59.44 297.18,59.44 297.28,59.53 297.28,60.79 298.11,61.62 299.37,61.62 300.74,62.99 DGND5.1
  pour Route2 (isolate 0.508): 265.43,49.28 264.16,48.01 264.16,5.84 392.94,5.84 398.53,11.43 398.53,66.55 398.02,67.06 431.04,67.06 434.85,70.87 434.85,119.38 431.29,122.94 389.38,122.94 371.6,105.16 371.6,87.38 357.63,73.41 313.18,73.41 289.05,49.28
GND_USBC  (14 unrouted)
MIDDLEWIPER1
  Top 0.254: R115.1 163.49,50.2 164.59,51.31 164.59,52.83 165.35,53.59 165.35,55.65 164.82,56.18 163.2,56.18 U1.45
MIDDLEWIPER2
  Top 0.254: X7.18 191.26,50.55 188.98,50.55 188.44,51.08 188.44,52.27 185.02,55.69 U1.80
MSPI1_MISO  (via drill 0.65)
  Top 0.254: U1.90 175.02,60.69 175.01,60.71 169.67,55.37 v169.67,55.12 | v113.79,59.18 112.25,60.72 J11.3
  Bottom 0.254: v169.67,55.12 168.91,54.36 166.37,54.36 162.81,57.91 156.46,57.91 155.19,59.18 v113.79,59.18
MSPI1_MOSI  (via drill 0.65)
  Top 0.254: U1.91 173.97,61.19 167.89,55.12 v167.64,55.37 | v115.57,60.2 114.25,61.52 J11.4
  Bottom 0.254: v167.64,55.37 166.62,55.37 163.07,58.93 156.97,58.93 155.7,60.2 v115.57,60.2
MSPI1_NSS  (via drill 0.65)
  Top 0.254: U1.92 177.07,61.69 177.04,61.72 172.47,61.72 167.89,57.15 v167.64,57.15
  Bottom 0.254: v167.64,57.15 166.62,57.15 162.81,60.96 160.02,60.96 159.26,61.72 112.27,61.72 110.25,63.74 J11.2
MSPI1_SCK  (via drill 0.65)
  Top 0.254: U1.89 176.27,60.19 172.21,56.13 v171.96,56.13
  Bottom 0.254: v171.96,56.13 170.94,55.12 170.94,54.61 169.93,53.59 165.61,53.59 162.31,56.9 155.96,56.9 154.69,58.17 111.76,58.17 108.25,61.67 J11.1
MSPI2_MISO
  Top 0.254: U1.33 158.04,62.19 157.57,61.72 133.35,61.72 129.29,65.79 124.21,65.79 123.43,65.01 J12.3
MSPI2_MOSI
  Top 0.254: U1.34 158.25,61.69 157.77,61.21 132.84,61.21 128.78,65.28 126.24,65.28 125.43,64.47 J12.4
MSPI2_NSS
  Top 0.254: U1.32 157.86,62.69 157.43,62.26 133.58,62.26 129.54,66.29 121.92,66.29 121.41,65.79 121.43,65.77 J12.2
MSPI2_SCK